# EAGLE schematic mainboard (EAGLE 9.6.2)
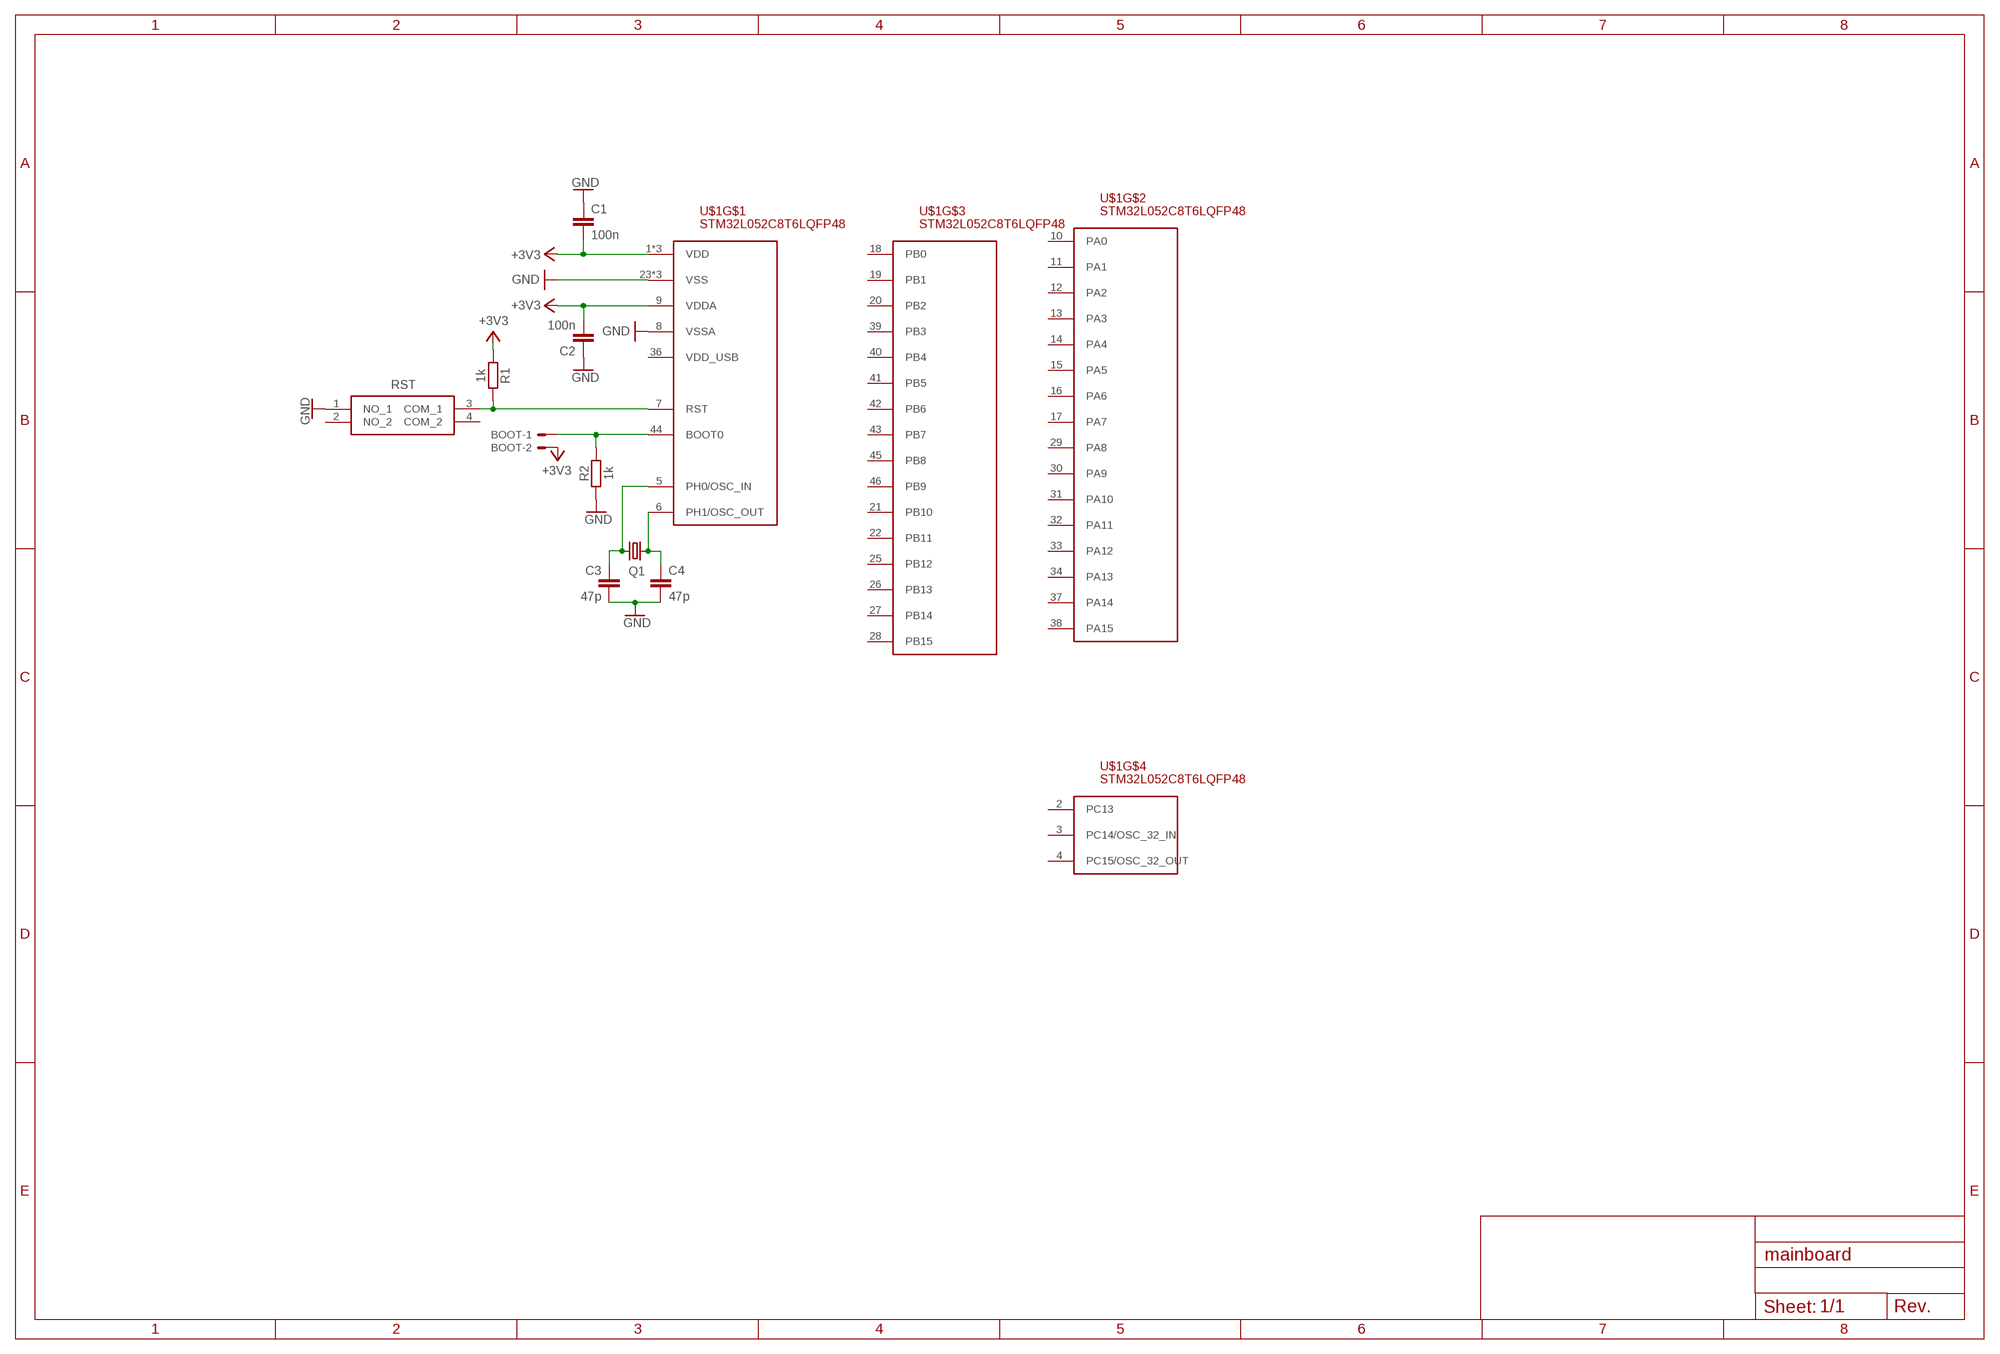
[diagram p0: schematic, sheet 1]

## Parts
BOOT  87758-0216  [87758-0216]
C1  100n  CAPACITORC-0603  [0603]
C2  100n  CAPACITORC-0603  [0603]
C3  47p  CAPACITORC-0603  [0603]
C4  47p  CAPACITORC-0603  [0603]
Q1  CRYSTALHC49U70  [HC49U70]
R1  1k  RESISTOR  [R0603]
R2  1k  RESISTOR  [R0603]
RST  BUTTON  [PTS647SK38SMTR2LFS]
U$1  STM32L052C8T6LQFP48  [QFP50P900X900X160-48N]

## Nets
+3V3: BOOT.2 C1.2 C2.2 R1.1 U$1.1(VDD) U$1.9(VDDA) U$1.24(VDD) U$1.48(VDD)
GND: C1.1 C2.1 C3.2 C4.2 R2.1 RST.1(NO_1) U$1.8(VSSA) U$1.23(VSS) U$1.35(VSS) U$1.47(VSS)
N$1: R1.2 RST.3(COM_1) U$1.7(RST)
N$2: BOOT.1 R2.2 U$1.44(BOOT0)
OSC1: C4.1 Q1.2 U$1.6(PH1/OSC_OUT)
OSC2: C3.1 Q1.1 U$1.5(PH0/OSC_IN)
Unconnected: RST.2(NO_2) RST.4(COM_2) U$1.2(PC13) U$1.3(PC14/OSC_32_IN) U$1.4(PC15/OSC_32_OUT) U$1.10(PA0) U$1.11(PA1) U$1.12(PA2) U$1.13(PA3) U$1.14(PA4) U$1.15(PA5) U$1.16(PA6) U$1.17(PA7) U$1.18(PB0) U$1.19(PB1) U$1.20(PB2) U$1.21(PB10) U$1.22(PB11) U$1.25(PB12) U$1.26(PB13) U$1.27(PB14) U$1.28(PB15) U$1.29(PA8) U$1.30(PA9) U$1.31(PA10) U$1.32(PA11) U$1.33(PA12) U$1.34(PA13) U$1.37(PA14) U$1.38(PA15) U$1.39(PB3) U$1.40(PB4) U$1.41(PB5) U$1.42(PB6) U$1.43(PB7) U$1.45(PB8) U$1.46(PB9)

## Power pins joined to a net without a drawn wire
VDD_USB: U$1.36(VDD_USB)

## Library data of the parts
BOOT = lib:87758-0216: 2 Pin - 2mm Dual Row Single Wafer, Vertical T/H HDR Source: http://www.molex.com/pdm_docs/sd/877580616_sd.pdf; MF: MOLEX; MPN: 87758-0216; OC_FARNELL: unknown; OC_NEWARK: 94M1513
C1-C4 = lib:CAPACITOR: Capacitor
Q1 = lib:CRYSTAL: CRYSTAL; LINK: https://www.elfa.se/en/quartz-tht-16mhz-iqd-lfxtal003240/p/17451701?q=&pos=1&origPos=1&origPageSize=50&track=true; MPN1: LFXTAL003240; OC_FARNELL: unknown; OC_NEWARK: unknown; SUPPLIER: ELFA
R1 R2 = lib:RESISTOR
RST = lib:BUTTON: PTS647SK50SMTR2LFS Tactile Switches 50mA 12VDC, 2.5N 3.8mm H, G leads; LINK: https://eu.mouser.com/ProductDetail/CK/PTS647SK50SMTR2LFS?qs=PqoDHHvF64%252BlD%252B2POA6piA%3D%3D; MPN: PTS647SK50SMTR2LFS; SUPPLIER: Mouser
U$1 = lib:STM32L052C8T6: STM32L052C8T6 - Microcontroller 32bit 64KB; LINK: https://www.elfa.se/en/microcontroller-32bit-64kb-lqfp-st-stm32l052c8t6/p/30170791?q=*&pos=14&origPos=23&origPageSize=50&track=true; MPN: STM32L052C8T6; SUPPLIER: ELFA